# Altium schematic sheet 06_MCU_Part3.SchDoc
size A3; SheetNumber: 6; SheetTotal: 7
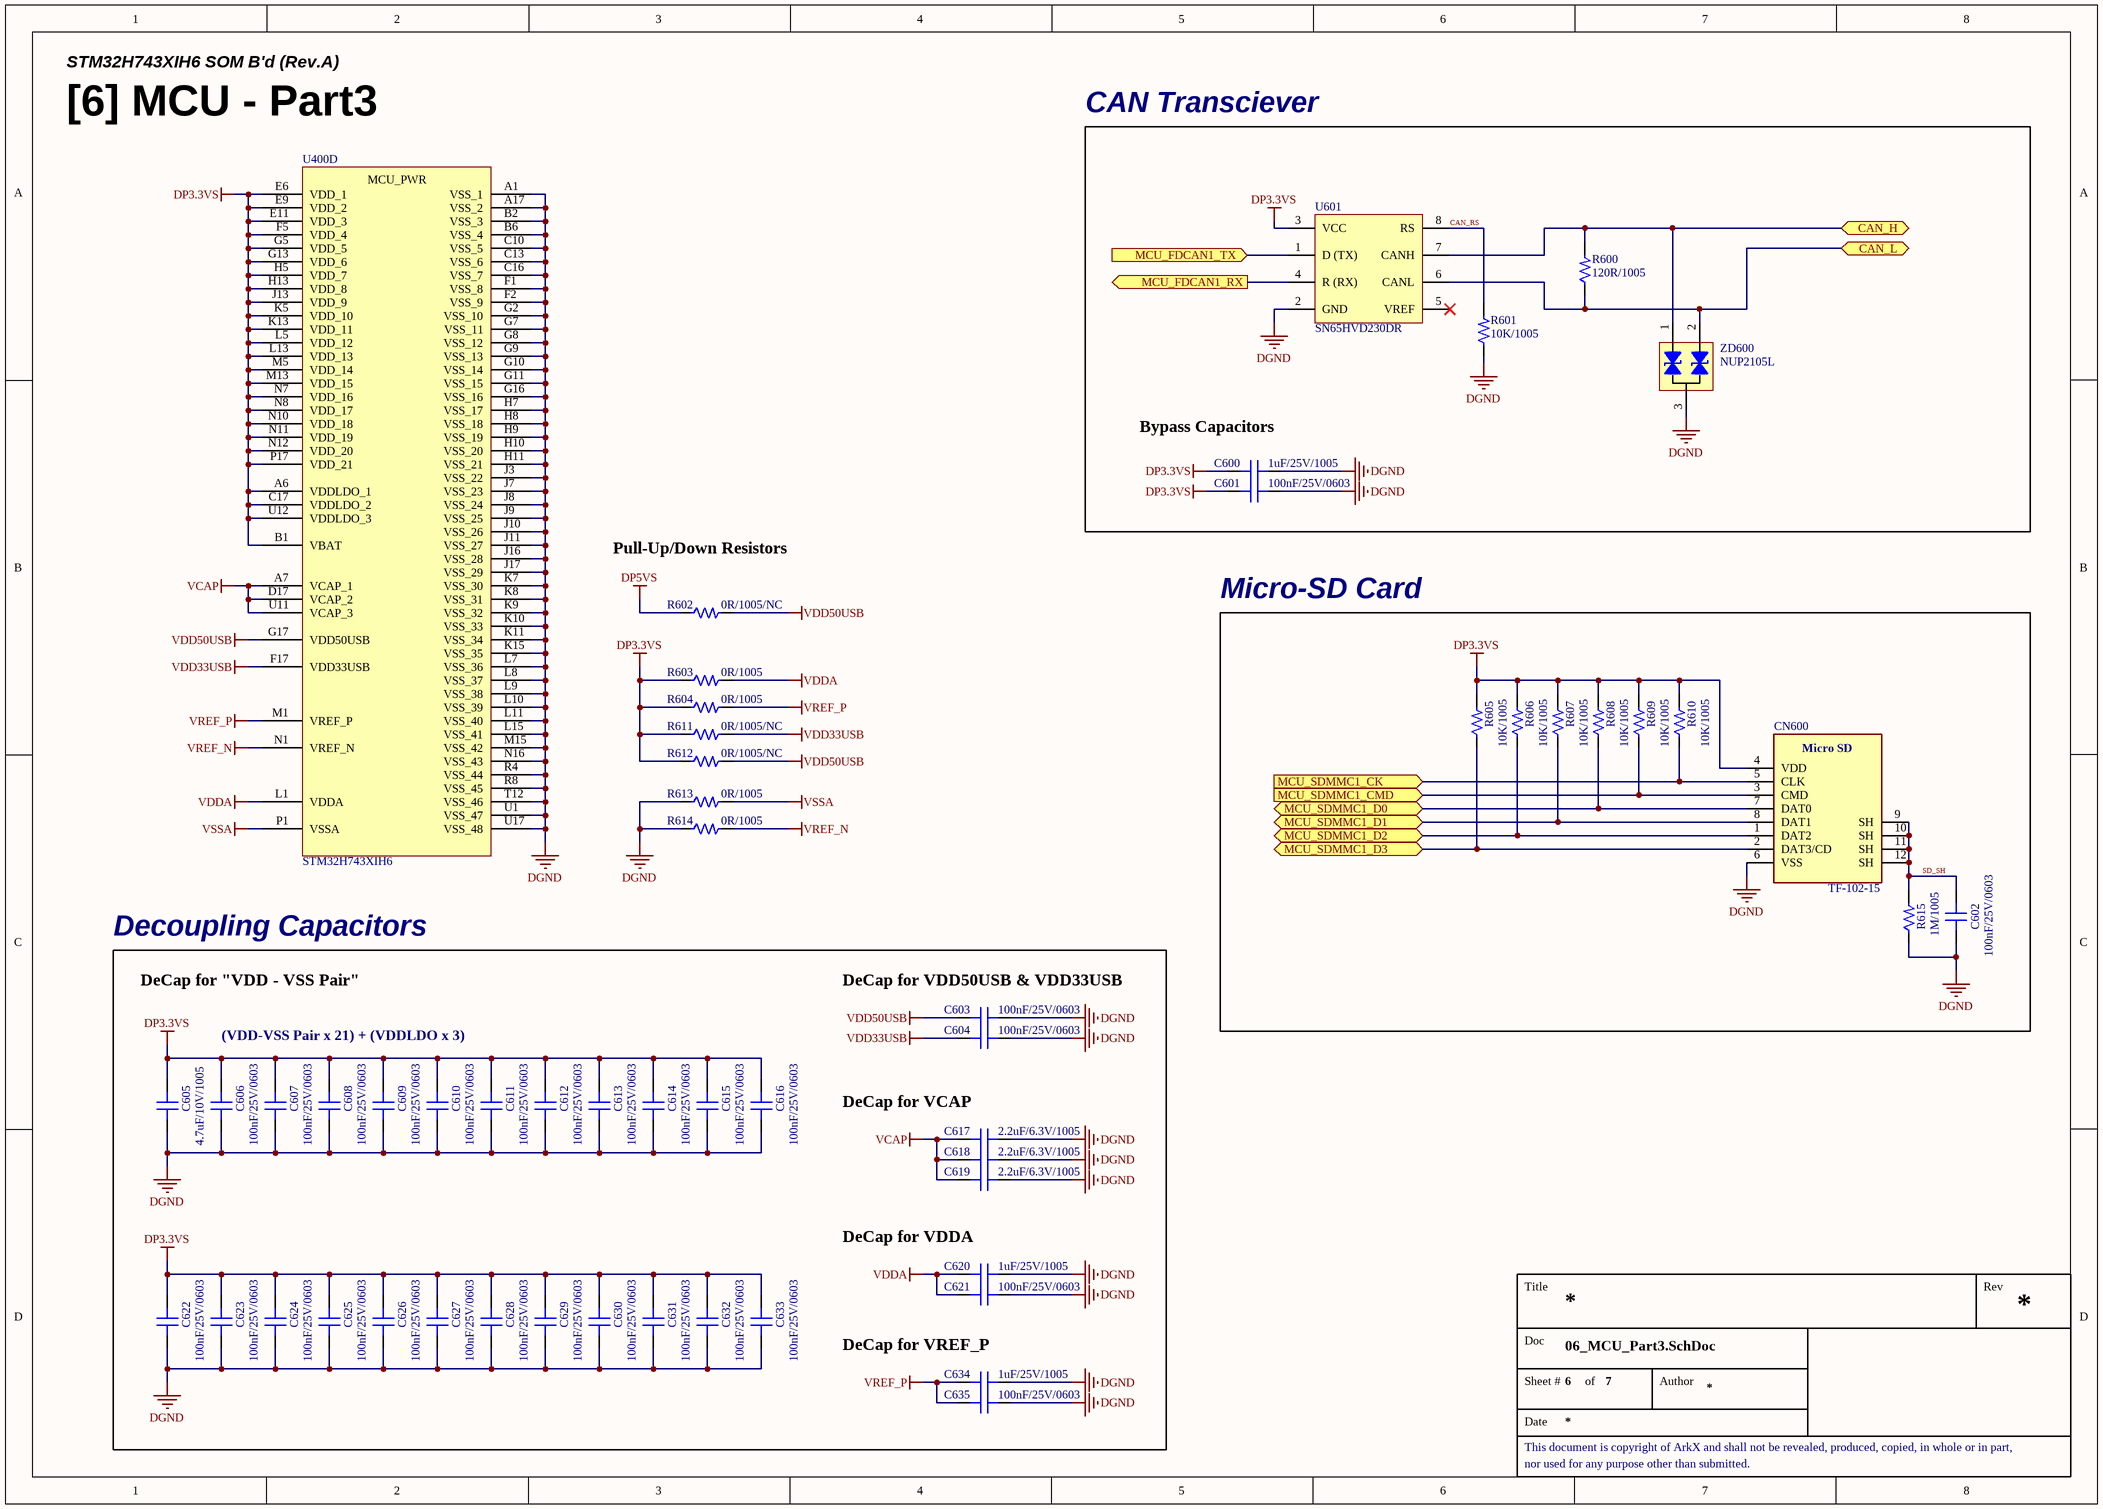
[diagram p0: 06_MCU_Part3.SchDoc]

## Parts
C600  1uF/25V/1005  [CAP 1005 (0402_INCH)]
C601  100nF/25V/0603  [CAP 0603 (0201_INCH)]
C602  100nF/25V/0603  [CAP 0603 (0201_INCH)]
C603  100nF/25V/0603  [CAP 0603 (0201_INCH)]
C604  100nF/25V/0603  [CAP 0603 (0201_INCH)]
C605  4.7uF/10V/1005  [CAP 1005 (0402_INCH)]
C606  100nF/25V/0603  [CAP 0603 (0201_INCH)]
C607  100nF/25V/0603  [CAP 0603 (0201_INCH)]
C608  100nF/25V/0603  [CAP 0603 (0201_INCH)]
C609  100nF/25V/0603  [CAP 0603 (0201_INCH)]
C610  100nF/25V/0603  [CAP 0603 (0201_INCH)]
C611  100nF/25V/0603  [CAP 0603 (0201_INCH)]
C612  100nF/25V/0603  [CAP 0603 (0201_INCH)]
C613  100nF/25V/0603  [CAP 0603 (0201_INCH)]
C614  100nF/25V/0603  [CAP 0603 (0201_INCH)]
C615  100nF/25V/0603  [CAP 0603 (0201_INCH)]
C616  100nF/25V/0603  [CAP 0603 (0201_INCH)]
C617  2.2uF/6.3V/1005  [CAP 1005 (0402_INCH)]
C618  2.2uF/6.3V/1005  [CAP 1005 (0402_INCH)]
C619  2.2uF/6.3V/1005  [CAP 1005 (0402_INCH)]
C620  1uF/25V/1005  [CAP 1005 (0402_INCH)]
C621  100nF/25V/0603  [CAP 0603 (0201_INCH)]
C622  100nF/25V/0603  [CAP 0603 (0201_INCH)]
C623  100nF/25V/0603  [CAP 0603 (0201_INCH)]
C624  100nF/25V/0603  [CAP 0603 (0201_INCH)]
C625  100nF/25V/0603  [CAP 0603 (0201_INCH)]
C626  100nF/25V/0603  [CAP 0603 (0201_INCH)]
C627  100nF/25V/0603  [CAP 0603 (0201_INCH)]
C628  100nF/25V/0603  [CAP 0603 (0201_INCH)]
C629  100nF/25V/0603  [CAP 0603 (0201_INCH)]
C630  100nF/25V/0603  [CAP 0603 (0201_INCH)]
C631  100nF/25V/0603  [CAP 0603 (0201_INCH)]
C632  100nF/25V/0603  [CAP 0603 (0201_INCH)]
C633  100nF/25V/0603  [CAP 0603 (0201_INCH)]
C634  1uF/25V/1005  [CAP 1005 (0402_INCH)]
C635  100nF/25V/0603  [CAP 0603 (0201_INCH)]
CN600  TF-102-15  [CON_MICRO-SD_Socket_TF-102-15]
R600  120R/1005  [RES 1005 (0402_inch)]
R601  10K/1005  [RES 1005 (0402_inch)]
R602  0R/1005/NC  [RES 1005 (0402_inch)/NC]
R603  0R/1005  [RES 1005 (0402_inch)]
R604  0R/1005  [RES 1005 (0402_inch)]
R605  10K/1005  [RES 1005 (0402_inch)]
R606  10K/1005  [RES 1005 (0402_inch)]
R607  10K/1005  [RES 1005 (0402_inch)]
R608  10K/1005  [RES 1005 (0402_inch)]
R609  10K/1005  [RES 1005 (0402_inch)]
R610  10K/1005  [RES 1005 (0402_inch)]
R611  0R/1005/NC  [RES 1005 (0402_inch)/NC]
R612  0R/1005/NC  [RES 1005 (0402_inch)/NC]
R613  0R/1005  [RES 1005 (0402_inch)]
R614  0R/1005  [RES 1005 (0402_inch)]
R615  1M/1005  [RES 1005 (0402_inch)]
U400  STM32H743XIH6  [IC TFBGA-265]  (part D of 4)
U601  SN65HVD230DR  [SOIC-8 R8 (ANALOG DEV)]
ZD600  NUP2105L  [SOT 23-3 (DIODES INCORPORATED)]

## Blocks framed on the sheet
CAN Transciever: C600 C601 R600 R601 U601 ZD600
Micro-SD Card: C602 CN600 R605-R610 R615
Decoupling Capacitors: C603-C635

## Ports
CAN_H (bidir), CAN_L (bidir), MCU_FDCAN1_RX (out), MCU_FDCAN1_TX (in), MCU_SDMMC1_CK (in), MCU_SDMMC1_CMD (in), MCU_SDMMC1_D0 (bidir), MCU_SDMMC1_D1 (bidir), MCU_SDMMC1_D2 (bidir), MCU_SDMMC1_D3 (bidir)

## Nets
DGND: C600.2 C601.1 C602.2 C603.1 C604.1 C605.1 C606.1 C607.1 C608.1 C609.1 C610.1 C611.1 C612.1 C613.1 C614.1 C615.1 C616.1 C617.2 C618.2 C619.2 C620.2 C621.1 C622.1 C623.1 C624.1 C625.1 C626.1 C627.1 C628.1 C629.1 C630.1 C631.1 C632.1 C633.1 C634.2 C635.1 CN600.6(VSS) R601.1 R613.1 R614.1 R615.1 U400.A1(VSS_1) U400.A17(VSS_2) U400.B2(VSS_3) U400.B6(VSS_4) U400.C10(VSS_5) U400.C13(VSS_6) U400.C16(VSS_7) U400.F1(VSS_8) U400.F2(VSS_9) U400.G2(VSS_10) U400.G7(VSS_11) U400.G8(VSS_12) U400.G9(VSS_13) U400.G10(VSS_14) U400.G11(VSS_15) U400.G16(VSS_16) U400.H7(VSS_17) U400.H8(VSS_18) U400.H9(VSS_19) U400.H10(VSS_20) U400.H11(VSS_21) U400.J3(VSS_22) U400.J7(VSS_23) U400.J8(VSS_24) U400.J9(VSS_25) U400.J10(VSS_26) U400.J11(VSS_27) U400.J16(VSS_28) U400.J17(VSS_29) U400.K7(VSS_30) U400.K8(VSS_31) U400.K9(VSS_32) U400.K10(VSS_33) U400.K11(VSS_34) U400.K15(VSS_35) U400.L7(VSS_36) U400.L8(VSS_37) U400.L9(VSS_38) U400.L10(VSS_39) U400.L11(VSS_40) U400.L15(VSS_41) U400.M15(VSS_42) U400.N16(VSS_43) U400.R4(VSS_44) U400.R8(VSS_45) U400.T12(VSS_46) U400.U1(VSS_47) U400.U17(VSS_48) U601.2(GND) ZD600.3(GND)
DP3.3VS: C600.1 C601.2 C605.2 C606.2 C607.2 C608.2 C609.2 C610.2 C611.2 C612.2 C613.2 C614.2 C615.2 C616.2 C622.2 C623.2 C624.2 C625.2 C626.2 C627.2 C628.2 C629.2 C630.2 C631.2 C632.2 C633.2 CN600.4(VDD) R603.1 R604.1 R605.2 R606.2 R607.2 R608.2 R609.2 R610.2 R611.1 R612.1 U400.A6(VDDLDO_1) U400.B1(VBAT) U400.C17(VDDLDO_2) U400.E6(VDD_1) U400.E9(VDD_2) U400.E11(VDD_3) U400.F5(VDD_4) U400.G5(VDD_5) U400.G13(VDD_6) U400.H5(VDD_7) U400.H13(VDD_8) U400.J13(VDD_9) U400.K5(VDD_10) U400.K13(VDD_11) U400.L5(VDD_12) U400.L13(VDD_13) U400.M5(VDD_14) U400.M13(VDD_15) U400.N7(VDD_16) U400.N8(VDD_17) U400.N10(VDD_18) U400.N11(VDD_19) U400.N12(VDD_20) U400.P17(VDD_21) U400.U12(VDDLDO_3) U601.3(VCC)
DP5VS: R602.1
VCAP: C617.1 C618.1 C619.1 U400.A7(VCAP_1) U400.D17(VCAP_2) U400.U11(VCAP_3)
VDD33USB: C604.2 R611.2 U400.F17(VDD33USB)
VDD50USB: C603.2 R602.2 R612.2 U400.G17(VDD50USB)
VDDA: C620.1 C621.2 R603.2 U400.L1(VDDA)
VREF_N: R614.2 U400.N1(VREF_N)
VREF_P: C634.1 C635.2 R604.2 U400.M1(VREF_P)
VSSA: R613.2 U400.P1(VSSA)
CAN_H: R600.2 U601.7(CANH) ZD600.1(CANH) ; port CAN_H
CAN_L: R600.1 U601.6(CANL) ZD600.2(CANL) ; port CAN_L
CAN_RS: R601.2 U601.8(RS)
MCU_FDCAN1_RX: U601.4(R_(RX)) ; port MCU_FDCAN1_RX
MCU_FDCAN1_TX: U601.1(D_(TX)) ; port MCU_FDCAN1_TX
MCU_SDMMC1_CK: CN600.5(CLK) R610.1 ; port MCU_SDMMC1_CK
MCU_SDMMC1_CMD: CN600.3(CMD) R609.1 ; port MCU_SDMMC1_CMD
MCU_SDMMC1_D0: CN600.7(DAT0) R608.1 ; port MCU_SDMMC1_D0
MCU_SDMMC1_D1: CN600.8(DAT1) R607.1 ; port MCU_SDMMC1_D1
MCU_SDMMC1_D2: CN600.1(DAT2) R606.1 ; port MCU_SDMMC1_D2
MCU_SDMMC1_D3: CN600.2(DAT3/CD) R605.1 ; port MCU_SDMMC1_D3
SD_SH: C602.1 CN600.9(SH) CN600.10(SH) CN600.11(SH) CN600.12(SH) R615.2

Not connected (* = marked no-connect by the designer): U601 5(VREF)*

## Notes on the sheet
- STM32H743XIH6 SOM B'd (Rev.A)
- [6] MCU - Part3
- Bypass Capacitors
- Pull-Up/Down Resistors
- DeCap for "VDD - VSS Pair"
- (near C603) DeCap for VDD50USB & VDD33USB
- (VDD-VSS Pair x 21) + (VDDLDO x 3)
- (near C617) DeCap for VCAP
- (near C620) DeCap for VDDA
- DeCap for VREF_P
- Title
- Rev
- Doc
- Sheet #
- of
- Author
- This document is copyright of ArkX and shall not be revealed, produced, copied, in whole or in part,
- Date
- nor used for any purpose other than submitted.
- (in symbol CON_MICRO-SD_Socket_TF-102-15) Micro SD
- (in symbol IC_MCU_STM32H743XIH6, part D) MCU_PWR

## Library data of the parts
C600 C620 C634 = CAP_1uF/25V/1005: Ceramic CAP_1uF/25V/1005; LCSC Part #: C52923; JLCPCB Part Type: Basic Part
C601-C604 C606-C616 C621-C633 C635 = CAP_100nF/25V/0603: Ceramic CAP_100nF/25V/0603; JLCPCB Part Type: Extended Part; LCSC Part #: C181047
C605 = CAP_4.7uF/10V/1005: 10V 4.7uF X5R ±20% 0402  Multilayer Ceramic Capacitors MLCC - SMD/SMT ROHS; JLCPCB Part Type: Basic Part; LCSC Part #: C23733
C617-C619 = CAP_2.2uF/6.3V/1005: Ceramic CAP_2.2uF/6.3V/1005; LCSC Part #: C12530; JLCPCB Part Type: Basic Part
CN600 = CON_MICRO-SD_Socket_TF-102-15: -25℃~+85℃ 1.6mm Gold Deck MicroSD card (TF card) 260℃ Phosphor coppe Clamshell SMD  SD Card Connectors ROHS; LCSC Part #: C266609; JLCPCB Part Type: Extended Part
R600 = RES_120R/1005/62.5mW: Value: 120R; Power Rating: 62.5mW; Precision: 1%; Size: 1005; LCSC Part #: C25079; JLCPCB Part Type: Basic Part
R601 R605-R610 = RES_10K/1005/62.5mW: Value: 10K; Power Rating: 62.5mW; Precision: 1%; Size: 1005; LCSC Part #: C25744; JLCPCB Part Type: Basic Part
R602 R611 R612 = RES_NC_0R/1005/62.5mW: RES_0R/1005/62.5mW/NC; Value: 0R; Power Rating: 62.5mW; Precision: 1%; Size: 1005
R603 R604 R613 R614 = RES_0R/1005/62.5mW: Value: 0R; Power Rating: 62.5mW; Precision: 1%; Size: 1005; LCSC Part #: C17168; JLCPCB Part Type: Basic Part
R615 = RES_1M/1005/62.5mW: Value: 1M; Power Rating: 62.5mW; Precision: 1%; Size: 1005; LCSC Part #: C26083; JLCPCB Part Type: Basic Part
U400 = IC_MCU_STM32H743XIH6: ARM® Cortex®-M7 STM32H7 MCU IC 32bit Single-core 480MHz 2MB(2M x 8) Flash 240+25-TFBGA(14x14); LCSC Part #: C114407; JLCPCB Part Type: Extended Part
U601 = IC_CAN_SN65HVD230DR: IC TRANSCEIVER HALF 1/1 8SOIC; LCSC Part #: C12084; JLCPCB Part Type: Basic Part
ZD600 = DIO_TVS_NUP2105L: SOT-23 ESD PROTECTION DEVICES RO; LCSC Part #: C5158054; JLCPCB Part Type: Extended Part